# Altium schematic sheet 07_CAN_Interface.SchDoc
size A4
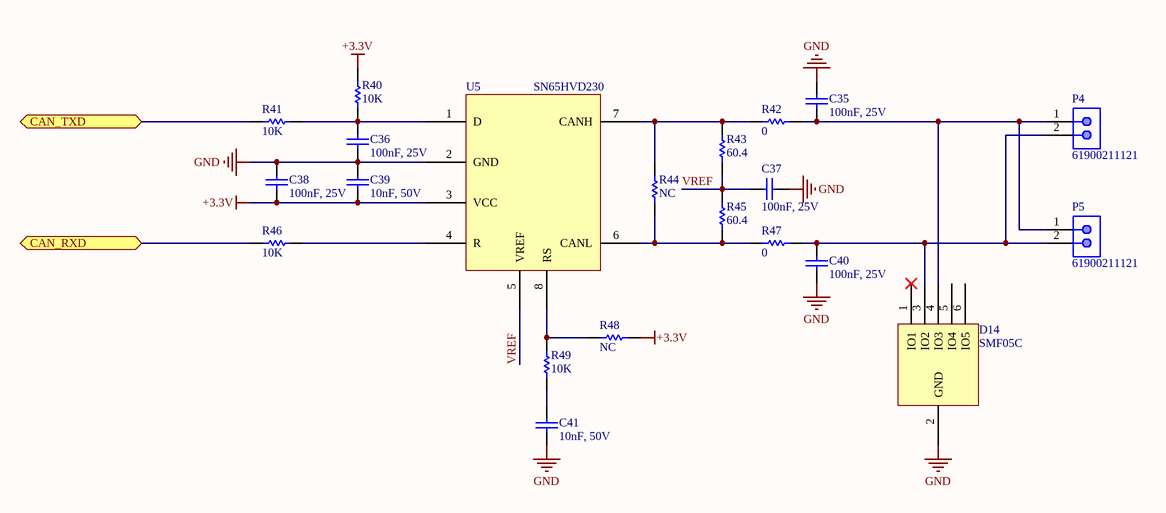
[diagram p0: 07_CAN_Interface.SchDoc]

## Parts
C35  100nF, 25V  [WCAP-CSGP_0603_H=0.8mm_Reflow]
C36  100nF, 25V  [WCAP-CSGP_0603_H=0.8mm_Reflow]
C37  100nF, 25V  [WCAP-CSGP_0603_H=0.8mm_Reflow]
C38  100nF, 25V  [WCAP-CSGP_0603_H=0.8mm_Reflow]
C39  10nF, 50V  [WCAP-CSGP_0603_H=0.8mm_Reflow]
C40  100nF, 25V  [WCAP-CSGP_0603_H=0.8mm_Reflow]
C41  10nF, 50V  [WCAP-CSGP_0603_H=0.8mm_Reflow]
D14  SMF05C  [SOT65P210X110-6N]
P4  61900211121  [61900211121]
P5  61900211121  [61900211121]
R40  value 10K  [RES-SM-0603]  (hidden comment: RESISTOR SMD)
R41  value 10K  [RES-SM-0603]  (hidden comment: RESISTOR SMD)
R42  value 0  [RES-SM-0603]  (hidden comment: RESISTOR SMD)
R43  value 60.4  [RES-SM-0603]  (hidden comment: RESISTOR SMD)
R44  value NC  [RES-SM-0603]  (hidden comment: RESISTOR SMD)
R45  value 60.4  [RES-SM-0603]  (hidden comment: RESISTOR SMD)
R46  value 10K  [RES-SM-0603]  (hidden comment: RESISTOR SMD)
R47  value 0  [RES-SM-0603]  (hidden comment: RESISTOR SMD)
R48  value NC  [RES-SM-0603]  (hidden comment: RESISTOR SMD)
R49  value 10K  [RES-SM-0603]  (hidden comment: RESISTOR SMD)
U5  SN65HVD230  [SOIC127P600X175-8N]

## Ports
CAN_RXD (bidir), CAN_TXD (bidir)

## Nets
+3.3V: C38.1 C39.1 R40.2 R48.1 U5.3(VCC)
GND: C35.2 C36.1 C37.1 C38.2 C39.2 C40.1 C41.1 D14.2(GND) U5.2(GND)
CAN_RXD: R46.2 ; port CAN_RXD
CAN_TXD: R41.2 ; port CAN_TXD
VREF: C37.2 R43.2 R45.1 U5.5(VREF)
NetC35_1: C35.1 D14.4(IO3) P4.1 P5.1 R42.1
NetC36_2: C36.2 R40.1 R41.1 U5.1(D)
NetC40_2: C40.2 D14.3(IO2) P4.2 P5.2 R47.1
NetC41_2: C41.2 R49.1
NetR42_2: R42.2 R43.1 R44.1 U5.7(CANH)
NetR44_2: R44.2 R45.2 R47.2 U5.6(CANL)
NetR46_1: R46.1 U5.4(R)
NetR48_2: R48.2 R49.2 U5.8(RS)

Not connected (* = marked no-connect by the designer): D14 1(IO1)* 5(IO4) 6(IO5)

## Library data of the parts
C35-C38 C40 = 885012206071: WCAP-CSGP Multilayer Ceramic Chip Capacitor, General Purpose, size 0603, X7R, 100nF, 25V; Manufacturer: Wurth Elektronik; Rated Voltage: 25VDC; Isolation Resistance: >=5GOhm; Capacitance Tolerance: +/-10%; Technical Reference: X7R0603104K025DFCT10000; ComponentLink1Description: Manufacturer; ComponentLink1URL: http://www.we-online.de; ComponentLink2Description: Datasheet; ComponentLink2URL: https://www.we-online.com/catalog/datasheet/885012206071.pdf; Operating Temperature: -55 to +125degC; Packaging: Tape and Reel; Manufacturer Part Number: 885012206071; Published Date: May 2020; Ceramic Type: X7R; Dissipation Factor: =<3.5%; Height: 0.8mm; Mounting Technology: SMT; Size: 0603; Capacitance: 100nF
C39 C41 = 885012206089: WCAP-CSGP Multilayer Ceramic Chip Capacitor, General Purpose, size 0603, X7R, 10nF, 50V; Manufacturer: Wurth Elektronik; Rated Voltage: 50VDC; Isolation Resistance: >=10GOhm; Capacitance Tolerance: +/-10%; Technical Reference: X7R0603103K050DFCT10000; ComponentLink1Description: Manufacturer; ComponentLink1URL: http://www.we-online.de; ComponentLink2Description: Datasheet; ComponentLink2URL: https://www.we-online.com/catalog/datasheet/885012206089.pdf; Operating Temperature: -55 to +125degC; Packaging: Tape and Reel; Manufacturer Part Number: 885012206089; Published Date: May 2020; Ceramic Type: X7R; Dissipation Factor: =<2.5%; Height: 0.8mm; Mounting Technology: SMT; Size: 0603; Capacitance: 10nF
P4 P5 = 61900211121: WR-WTB THT Male Vertical Locking Header, pitch 2.54mm, 2p; Pin Number: 2; Contact Resistance: 20mOhm; Rated Current: 3A; Withstanding Voltage: 1000VAC; Working Voltage: 250VAC; ComponentLink1Description: Manufacturer; ComponentLink1URL: http://www.we-online.de; ComponentLink2Description: Datasheet; ComponentLink2URL: https://www.we-online.com/catalog/datasheet/61900211121.pdf; Pitch: 2.54mm; Published Date: January 2020; Publisher: Wurth Elektronik; Mounting Technology: THT; Packaging: Bag; Operating Temperature: -40 to +105degC; Part Number: 61900211121; Gender: Male; Type: Vertical
R40-R49 = RESISTOR SMD: Resistor